# Altium schematic sheet Motor Interface - CAN.SchDoc: Motor Interface - CAN
size B; PageSetup: Record=PageOptions|CenterHorizontal=True|CenterVertical=True|PrintScale=0.64|XCorrection=1.00|YCorrection=1.00|PrintKind=1|BorderSize=5000000|LeftOffset=0|BottomOffset=0|Orientation=2|PaperLength=1000|PaperWidth=1000|Scale=100|PaperSource=7|PrintQuality=-3|MediaType=1|DitherType=10|PrintScaleMode=1|PaperKind=Letter|PaperIndex=1; Organization: Midnight Sun Solar Rayce Car Team; Address1: University of Waterloo; Address2: 200 University Ave W; Address3: Waterloo, ON, Canada; Address4: N2L 3E9; DocumentNumber: 3; SheetNumber: 3; SheetTotal: 6; Website: www.uwmidsun.com; ProjectName: ProjectName
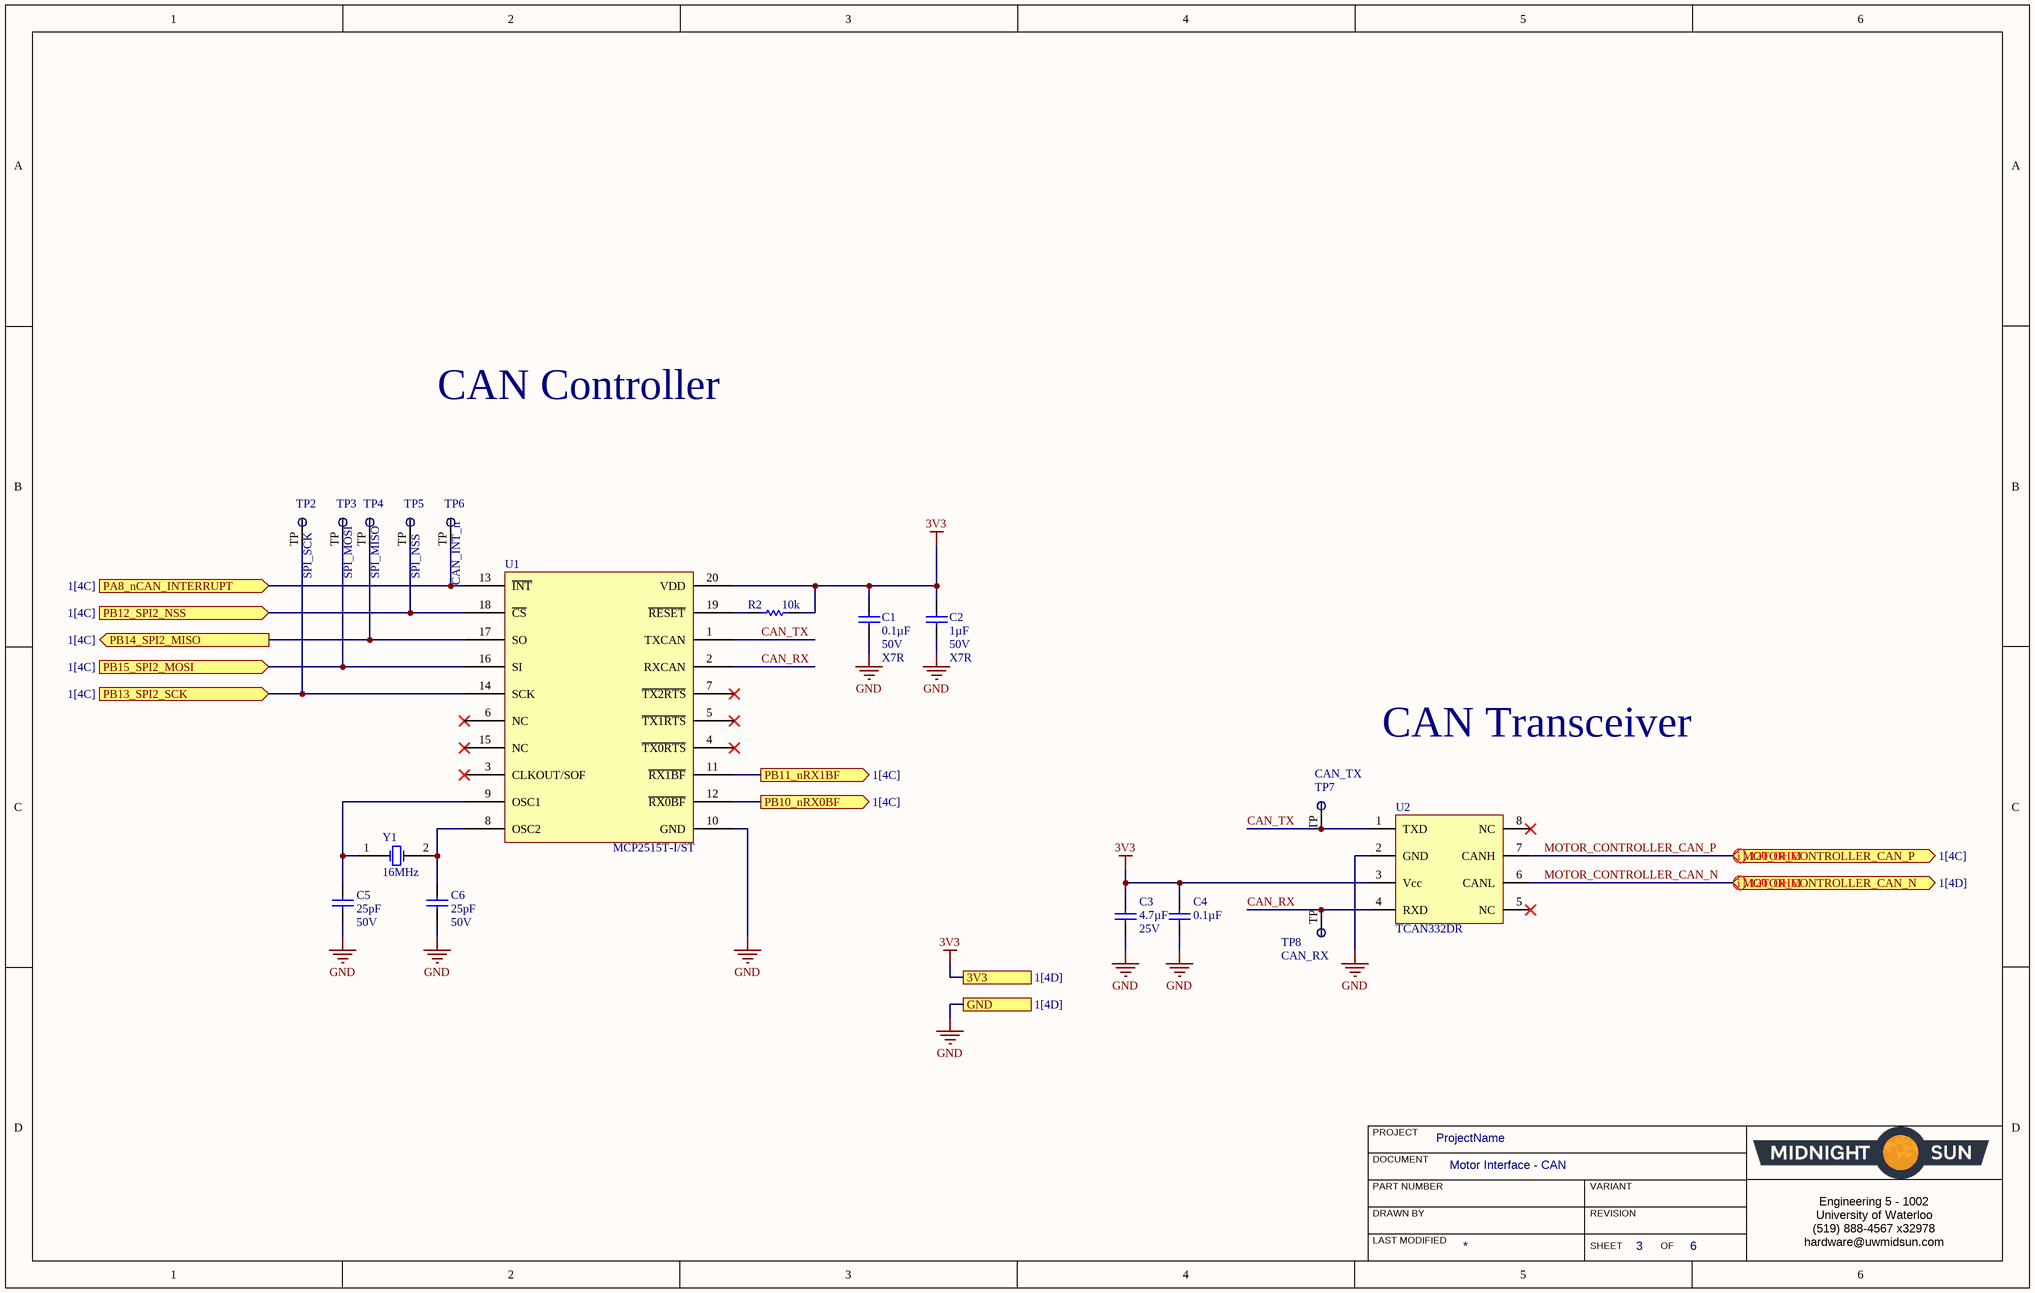
[diagram p0: Motor Interface - CAN.SchDoc]

## Parts
C1  Capacitance: 0.1µF  Voltage: 50V  Temperature Coefficient: X7R  [CAP, 0603]  (hidden comment: CAP CER 0.1UF 50V 10% X7R 0603)
C2  Capacitance: 1µF  Voltage: 50V  Temperature Coefficient: X7R  [CAP, 0603]  (hidden comment: CAP CER 1UF 50V 10% X7R 0603)
C3  Voltage: 25V  Capacitance: 4.7µF  [CAP, 0603]  (hidden comment: CAP CER 4.7UF 25V 10% X5R 0603)
C4  Capacitance: 0.1µF  [CAP, 0603]  (hidden comment: CAP CER 0.1UF 50V 10% X7R 0603)
C5  Voltage - Rated: 50V  Capacitance: 25pF  [CAP, 0603]  (hidden comment: CAP CER 25PF 50V ±5% C0G/NP0 0603)
C6  Voltage - Rated: 50V  Capacitance: 25pF  [CAP, 0603]  (hidden comment: CAP CER 25PF 50V ±5% C0G/NP0 0603)
R2  Resistance: 10k  [RES, 0603]  (hidden comment: RES 10K OHM 1% 1/10W 0603)
TP2  SPI_SCK  [Test Point]  (no BOM)
TP3  SPI_MOSI  [Test Point]  (no BOM)
TP4  SPI_MISO  [Test Point]  (no BOM)
TP5  SPI_NSS  [Test Point]  (no BOM)
TP6  CAN_INT_n  [Test Point]  (no BOM)
TP7  CAN_TX  [Test Point]  (no BOM)
TP8  CAN_RX  [Test Point]  (no BOM)
U1  Manufacturer Part Number: MCP2515T-I/ST  [TSSOP65P640X120-20N]  (hidden comment: MCP2515)
U2  Manufacturer Part Number: TCAN332DR  [TSOP65P280X145-8N]  (hidden comment: IC CAN Tranceiver TCAN332DR)
Y1  Frequency: 16MHz  [ABM3 CRYSTAL]  (hidden comment: CRYSTAL 16 MHz 18PF 2-SMD)

## Ports
3V3 (see 1[4D]), GND (see 1[4D]), MOTOR_CONTROLLER_CAN_N (bidir, see 1[4D]), MOTOR_CONTROLLER_CAN_P (bidir, see 1[4C]), PA8_nCAN_INTERRUPT (in, see 1[4C]), PB10_nRX0BF (out, see 1[4C]), PB11_nRX1BF (out, see 1[4C]), PB12_SPI2_NSS (in, see 1[4C]), PB13_SPI2_SCK (in, see 1[4C]), PB14_SPI2_MISO (out, see 1[4C]), PB15_SPI2_MOSI (in, see 1[4C])

## Nets
3V3: C1.1 C2.1 C3.2 C4.2 R2.2 U1.20(VDD) U2.3(Vcc) ; port 3V3
GND: C1.2 C2.2 C3.1 C4.1 C5.2 C6.2 U1.10(GND) U2.2(GND) ; port GND
CAN_RX: TP8.TP U1.2(RXCAN) U2.4(RXD)
CAN_TX: TP7.TP U1.1(TXCAN) U2.1(TXD)
MOTOR_CONTROLLER_CAN_N: U2.6(CANL) ; port MOTOR_CONTROLLER_CAN_N
MOTOR_CONTROLLER_CAN_P: U2.7(CANH) ; port MOTOR_CONTROLLER_CAN_P
PA8_nCAN_INTERRUPT: TP6.TP U1.13(~{INT}) ; port PA8_nCAN_INTERRUPT
PB10_nRX0BF: U1.12(~{RX0BF}) ; port PB10_nRX0BF
PB11_nRX1BF: U1.11(~{RX1BF}) ; port PB11_nRX1BF
PB12_SPI2_NSS: TP5.TP U1.18(~{CS}) ; port PB12_SPI2_NSS
PB13_SPI2_SCK: TP2.TP U1.14(SCK) ; port PB13_SPI2_SCK
PB14_SPI2_MISO: TP4.TP U1.17(SO) ; port PB14_SPI2_MISO
PB15_SPI2_MOSI: TP3.TP U1.16(SI) ; port PB15_SPI2_MOSI
NetC5_1: C5.1 U1.9(OSC1) Y1.1
NetC6_1: C6.1 U1.8(OSC2) Y1.2
NetR2_1: R2.1 U1.19(~{RE}~{SET})

Not connected (* = marked no-connect by the designer): U1 3(CLKOUT/SOF)* 4(~{TX0RTS})* 5(~{TX1RTS})* 6(NC)* 7(~{TX2RTS})* 15(NC)*; U2 5(NC)* 8(NC)*

## Layout directives
differential pair: MOTOR_CONTROLLER_CAN_N, MOTOR_CONTROLLER_CAN_P

## Notes on the sheet
- CAN Controller
- CAN Transceiver
- PROJECT
- DOCUMENT
- DRAWN BY
- LAST MODIFIED
- PART NUMBER
- REVISION
- SHEET
- VARIANT
- OF
- Engineering 5 - 1002
  University of Waterloo
  (519) 888-4567 x32978
  hardware@uwmidsun.com

## Library data of the parts
C1 C4 = CAP CER 0.1UF 50V 10% X7R 0603: 0.10µF ±10% 50V Ceramic Capacitor X7R 0603 (1608 Metric); Manufacturer 1: AVX Corporation; Manufacturer Part Number 1: 06035C104KAT2A; Supplier 1: Digi-Key; Supplier Part Number 1: 478-5052-1-ND; Packaging: Cut Tape (CT); Part Status: Active; Operating Temperature: -55°C ~ 125°C; Ratings: -; Mounting Type: Surface Mount, MLCC; Package / Case: 0603 (1608 Metric); Size / Dimension: 0.063" L x 0.032" W (1.60mm x 0.81mm); Height - Seated (Max): -; Thickness (Max): 0.035" (0.90mm); Lead Spacing: -; Lead Style: -; ComponentLink1URL: http://datasheets.avx.com/X7RDielectric.pdf; ComponentLink1Description: http://datasheets.avx.com/X7RDielectric.pdf; Tolerance: ±10%
  C4: Voltage: 50V; Temperature Coefficient: X7R
C2 = CAP CER 1UF 50V 10% X7R 0603: 1µF ±10% 50V Ceramic Capacitor X7R 0603 (1608 Metric); Manufacturer 1: Taiyo Yuden; Manufacturer Part Number 1: UMK107AB7105KA-T; Supplier 1: Digi-Key; Supplier Part Number 1: 587-3247-1-ND; Packaging: Cut Tape (CT); Part Status: Active; Operating Temperature: -55°C ~ 125°C; Ratings: -; Mounting Type: Surface Mount, MLCC; Package / Case: 0603 (1608 Metric); Size / Dimension: 0.063" L x 0.031" W (1.60mm x 0.80mm); Height - Seated (Max): -; Thickness (Max): 0.037" (0.95mm); Lead Spacing: -; Lead Style: -; ComponentLink1URL: http://www.yuden.co.jp/productdata/catalog/en/mlcc_all_e.pdf; ComponentLink1Description: http://www.yuden.co.jp/productdata/catalog/en/mlcc_all_e.pdf; Tolerance: ±10%
C3 = CAP CER 4.7UF 25V 10% X5R 0603: 4.7µF ±10% 25V Ceramic Capacitor X5R 0603 (1608 Metric); Manufacturer 1: Murata Electronics North America; Manufacturer Part Number 1: GRM188R61E475KE11D; Supplier 1: Digi-Key; Supplier Part Number 1: 490-7203-1-ND; Packaging: Cut Tape (CT); Part Status: Active; Operating Temperature: -55°C ~ 85°C; Ratings: -; Mounting Type: Surface Mount, MLCC; Package / Case: 0603 (1608 Metric); Size / Dimension: 0.063" L x 0.031" W (1.60mm x 0.80mm); Height - Seated (Max): -; Thickness (Max): 0.031" (0.80mm); Lead Spacing: -; Lead Style: -; ComponentLink1URL: http://www.murata.com/~/media/webrenewal/support/library/catalog/products/capacitor/mlcc/c02e.ashx; ComponentLink1Description: http://www.murata.com/~/media/webrenewal/support/library/catalog/products/capacitor/mlcc/c02e.ashx; Tolerance: ±10%; Temperature Coefficient: X5R
C5 C6 = CAP CER 25PF 50V ±5% C0G/NP0 0603: 25pF 50V Ceramic Capacitor C0G, NP0 0603 (1608 Metric) 0.063" L x 0.032" W (1.60mm x 0.80mm); Manufacturer: Samsung Electro-Mechanics; Manufacturer Part Number: CL10C250JB8NNNC; Notification: Current market demand for these product types have resulted in fluctuating and extending lead times. Lead times may differ.; Supplier 1: Digi-Key; RoHS: RoHS Compliant; Category: Capacitors; Stock 1: 36668; Pricing 1: 1=0.14, 10=0.061, 100=0.0274, 500=0.01962, 1000=0.01542 (CAD); Packaging: Cut Tape (CT); Part Status: Active; Tolerance: ±5%; Operating Temperature: -55°C ~ 125°C; Features: -; Ratings: -; Applications: General Purpose; Mounting Type: Surface Mount, MLCC; Package / Case: 0603 (1608 Metric); Size / Dimension: 0.063" L x 0.032" W (1.60mm x 0.80mm); Height - Seated (Max): -; Thickness (Max): 0.035" (0.90mm); Lead Spacing: -; Lead Style: -; ComponentLink1URL: http://www.samsungsem.com/kr/support/product-search/mlcc/CL10C250JB8NNNC.jsp; ComponentLink1Description: http://www.samsungsem.com/kr/support/product-search/mlcc/CL10C250JB8NNNC.jsp; Supplier Part Number 1: 1276-2244-1-ND; Temperature Coefficient: C0G, NP0
R2 = RES 10K OHM 1% 1/10W 0603: RES SMD 10K OHM 1% 1/10W 0603; Manufacturer 1: Yageo; Manufacturer Part Number 1: RC0603FR-0710KL; Temperature Coefficient: ±100ppm/°C; Supplier 1: Digi-Key; Supplier Part Number 1: 311-10.0KHRCT-ND; Packaging: Cut Tape (CT); Part Status: Active; Composition: Thick Film; Operating Temperature: -55°C ~ 155°C; Package / Case: 0603 (1608 Metric); Supplier Device Package: 0603; Size / Dimension: 0.063" L x 0.031" W (1.60mm x 0.80mm); Height - Seated (Max): 0.022" (0.55mm); Failure Rate: -; ComponentLink1URL: http://www.yageo.com/documents/recent/PYu-RC_Group_51_RoHS_L_7.pdf; ComponentLink1Description: http://www.yageo.com/documents/recent/PYu-RC_Group_51_RoHS_L_7.pdf; Tolerance: ±1%; Power: 1/10W
TP2-TP8 = Test Point
U1 = IC CAN SPI CONTROLLER MCP2515T-I/ST 20-TSSOP: CAN Controller CAN 2.0 SPI Interface 20-TSSOP; Manufacturer: Microchip Technology; Standards: CAN 2.0; Voltage - Supply: 2.7 V ~ 5.5 V; Current - Supply: 10mA; Supplier 1: Digi-Key; RoHS: RoHS Compliant; Category: Integrated Circuits (ICs); Stock 1: 27278; Pricing 1: 1=3.04, 25=2.5372, 100=2.3076 (CAD); Packaging: Cut Tape (CT); Part Status: Active; Protocol: CAN; Function: Controller; Interface: SPI; Operating Temperature: -40°C ~ 85°C; Package / Case: 20-TSSOP (0.173", 4.40mm Width); Supplier Device Package: 20-TSSOP; Base Part Number: MCP2515; ComponentLink1URL: http://www.microchip.com/mymicrochip/filehandler.aspx?ddocname=en011733; ComponentLink1Description: http://www.microchip.com/mymicrochip/filehandler.aspx?ddocname=en011733; Supplier Part Number 1: MCP2515T-I/STCT-ND
U2 = IC CAN Tranceiver TCAN332DR: 1/1 Transceiver CAN 8-SOIC; Supplier 1: Digi-Key; Supplier Part Number 1: 296-43711-1-ND; Digikey Part Number: 296-43711-1-ND
Y1 = CRYSTAL 16 MHz 18PF 2-SMD: 16MHz ±20ppm Crystal 18pF 40 Ohms 2-SMD, No Lead; Manufacturer: Abracon LLC; Manufacturer Part Number: ABM3-16.000MHZ-D2Y-T; Frequency Stability: ±30ppm; Operating Mode: Fundamental; Supplier 1: Digi-Key; RoHS: RoHS Compliant; Category: Crystals, Oscillators, Resonators; Stock 1: 27142; Pricing 1: 1=1.02, 10=0.858, 50=0.7712, 100=0.6855, 500=0.6512 (CAD); Packaging: Cut Tape (CT); Part Status: Active; Type: MHz Crystal; Frequency Tolerance: ±20ppm; Load Capacitance: 18pF; Operating Temperature: -40°C ~ 85°C; Ratings: -; Mounting Type: Surface Mount; Package / Case: 2-SMD, No Lead; Size / Dimension: 0.197" L x 0.126" W (5.00mm x 3.20mm); Height - Seated (Max): 0.051" (1.30mm); ComponentLink1URL: https://abracon.com/Resonators/abm3.pdf; ComponentLink1Description: https://abracon.com/Resonators/abm3.pdf; Supplier Part Number 1: 535-10638-1-ND